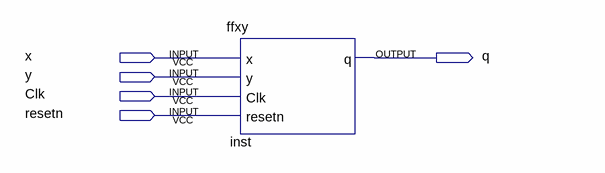
[diagram p0: schematic sheet]
// Quartus schematic Leccion.bdf as structural Verilog: 1 symbols, 5 pins
module Leccion (
  input  x,
  input  y,
  input  Clk,
  input  resetn,
  output q
);

  ffxy inst (.x(x), .y(y), .Clk(Clk), .resetn(resetn), .q(q));
endmodule
